# EAGLE design tresor (EAGLE 5.10)
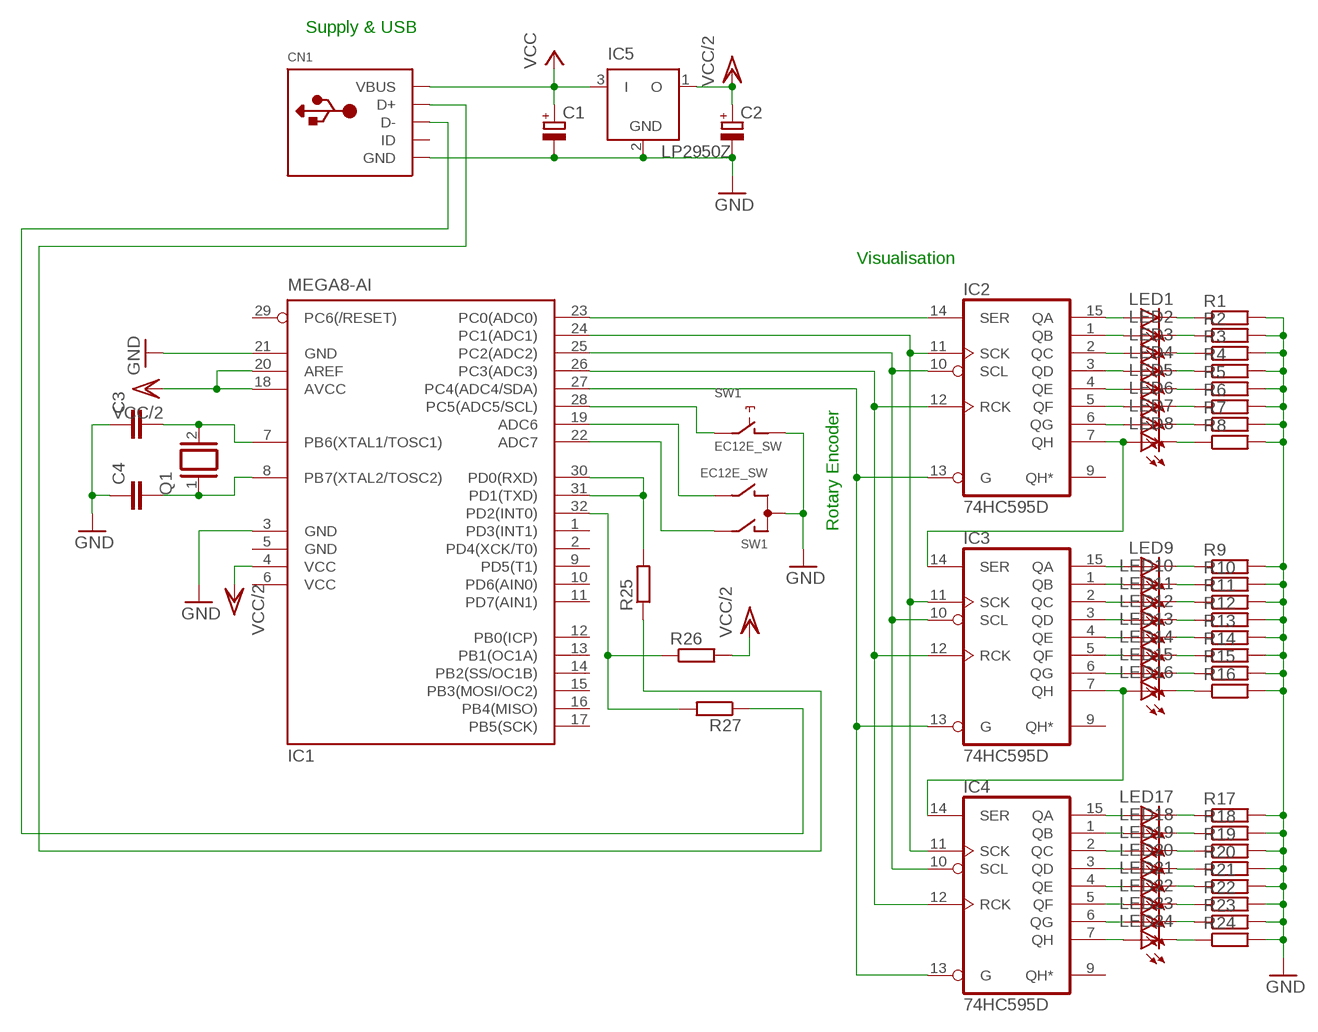
[diagram p0: schematic, sheet 1]

## Parts
C1  CPOL-EUE2.5-5  [E2,5-5]
C2  CPOL-EUE2.5-5  [E2,5-5]
C3  C-EUC0805  [C0805]
C4  C-EUC0805  [C0805]
CN1  USBMINIB  [USB-MINIB]
IC1  MEGA8-AI  [TQFP32-08]
IC2  74HC595D  [SO16]
IC3  74HC595D  [SO16]
IC4  74HC595D  [SO16]
IC5  LP2950Z  [TO92]
LED1  LED3MM  [LED3MM]
LED2  LED3MM  [LED3MM]
LED3  LED3MM  [LED3MM]
LED4  LED3MM  [LED3MM]
LED5  LED3MM  [LED3MM]
LED6  LED3MM  [LED3MM]
LED7  LED3MM  [LED3MM]
LED8  LED3MM  [LED3MM]
LED9  LED3MM  [LED3MM]
LED10  LED3MM  [LED3MM]
LED11  LED3MM  [LED3MM]
LED12  LED3MM  [LED3MM]
LED13  LED3MM  [LED3MM]
LED14  LED3MM  [LED3MM]
LED15  LED3MM  [LED3MM]
LED16  LED3MM  [LED3MM]
LED17  LED3MM  [LED3MM]
LED18  LED3MM  [LED3MM]
LED19  LED3MM  [LED3MM]
LED20  LED3MM  [LED3MM]
LED21  LED3MM  [LED3MM]
LED22  LED3MM  [LED3MM]
LED23  LED3MM  [LED3MM]
LED24  LED3MM  [LED3MM]
Q1  XTAL/S  [QS]
R1  R-EU_M0805  [M0805]
R2  R-EU_M0805  [M0805]
R3  R-EU_M0805  [M0805]
R4  R-EU_M0805  [M0805]
R5  R-EU_M0805  [M0805]
R6  R-EU_M0805  [M0805]
R7  R-EU_M0805  [M0805]
R8  R-EU_M0805  [M0805]
R9  R-EU_M0805  [M0805]
R10  R-EU_M0805  [M0805]
R11  R-EU_M0805  [M0805]
R12  R-EU_M0805  [M0805]
R13  R-EU_M0805  [M0805]
R14  R-EU_M0805  [M0805]
R15  R-EU_M0805  [M0805]
R16  R-EU_M0805  [M0805]
R17  R-EU_M0805  [M0805]
R18  R-EU_M0805  [M0805]
R19  R-EU_M0805  [M0805]
R20  R-EU_M0805  [M0805]
R21  R-EU_M0805  [M0805]
R22  R-EU_M0805  [M0805]
R23  R-EU_M0805  [M0805]
R24  R-EU_M0805  [M0805]
R25  R-EU_M0805  [M0805]
R26  R-EU_M0805  [M0805]
R27  R-EU_M0805  [M0805]
SW1  EC12E_SW  [ALPS_EC12E_SW]

## Nets
D+: CN1.D+ R25.1
D-: CN1.D- R27.1
GND: C1.- C2.- C3.1 C4.1 CN1.GND IC1.3(GND) IC1.21(GND) IC5.2(GND) R1.2 R2.2 R3.2 R4.2 R5.2 R6.2 R7.2 R8.2 R9.2 R10.2 R11.2 R12.2 R13.2 R14.2 R15.2 R16.2 R17.2 R18.2 R19.2 R20.2 R21.2 R22.2 R23.2 R24.2 SW1.C SW1.D
N$1: IC2.15(QA) LED1.A
N$2: IC2.1(QB) LED2.A
N$3: IC2.2(QC) LED3.A
N$4: IC2.3(QD) LED4.A
N$5: IC2.4(QE) LED5.A
N$6: IC2.5(QF) LED6.A
N$7: IC2.6(QG) LED7.A
N$8: IC2.7(QH) IC3.14(SER) LED8.A
N$9: IC3.15(QA) LED9.A
N$10: IC3.1(QB) LED10.A
N$11: IC3.2(QC) LED11.A
N$12: IC3.3(QD) LED12.A
N$13: IC3.4(QE) LED13.A
N$14: IC3.5(QF) LED14.A
N$15: IC3.6(QG) LED15.A
N$16: IC3.7(QH) IC4.14(SER) LED16.A
N$17: IC4.15(QA) LED17.A
N$18: IC4.1(QB) LED18.A
N$19: IC4.2(QC) LED19.A
N$20: IC4.3(QD) LED20.A
N$21: IC4.4(QE) LED21.A
N$22: IC4.5(QF) LED22.A
N$23: IC4.6(QG) LED23.A
N$24: IC4.7(QH) LED24.A
N$25: LED24.K(C) R24.1
N$26: LED23.K(C) R23.1
N$27: LED22.K(C) R22.1
N$28: LED21.K(C) R21.1
N$29: LED20.K(C) R20.1
N$30: LED19.K(C) R19.1
N$31: LED18.K(C) R18.1
N$32: LED17.K(C) R17.1
N$33: LED16.K(C) R16.1
N$34: LED15.K(C) R15.1
N$35: LED14.K(C) R14.1
N$36: LED13.K(C) R13.1
N$37: LED12.K(C) R12.1
N$38: LED11.K(C) R11.1
N$39: LED10.K(C) R10.1
N$40: LED9.K(C) R9.1
N$41: LED8.K(C) R8.1
N$42: LED7.K(C) R7.1
N$43: LED6.K(C) R6.1
N$44: LED5.K(C) R5.1
N$45: LED4.K(C) R4.1
N$46: LED3.K(C) R3.1
N$47: LED2.K(C) R2.1
N$48: LED1.K(C) R1.1
N$50: IC1.23(PC0(ADC0)) IC2.14(SER)
N$51: IC1.25(PC2(ADC2)) IC2.10(SCL) IC3.10(SCL) IC4.10(SCL)
N$52: IC1.24(PC1(ADC1)) IC2.11(SCK) IC3.11(SCK) IC4.11(SCK)
N$53: IC1.28(PC5(ADC5/SCL)) SW1.E
N$54: IC1.19(ADC6) SW1.B
N$55: IC1.22(ADC7) SW1.A
N$57: C3.2 IC1.7(PB6(XTAL1/TOSC1)) Q1.2
N$58: C4.2 IC1.8(PB7(XTAL2/TOSC2)) Q1.1
N$59: IC1.30(PD0(RXD)) IC1.31(PD1(TXD)) R25.2
N$60: IC1.32(PD2(INT0)) R26.1 R27.2
N$62: IC1.26(PC3(ADC3)) IC2.12(RCK) IC3.12(RCK) IC4.12(RCK)
N$63: IC1.27(PC4(ADC4/SDA)) IC2.13(G) IC3.13(G) IC4.13(G)
VCC: C1.+ CN1.VBUS IC5.3(I)
VCC/2: C2.+ IC1.4(VCC) IC1.18(AVCC) IC1.20(AREF) IC5.1(O) R26.2
Unconnected: CN1.ID IC1.1(PD3(INT1)) IC1.2(PD4(XCK/T0)) IC1.9(PD5(T1)) IC1.10(PD6(AIN0)) IC1.11(PD7(AIN1)) IC1.12(PB0(ICP)) IC1.13(PB1(OC1A)) IC1.14(PB2(SS/OC1B)) IC1.15(PB3(MOSI/OC2)) IC1.16(PB4(MISO)) IC1.17(PB5(SCK)) IC1.29(PC6(/RESET)) IC2.9(QH*) IC3.9(QH*) IC4.9(QH*) SW1.GND1(G) SW1.GND2(G)

## Notes on the sheet
- Supply & USB
- Visualisation
- Rotary Encoder

## Power pins joined to a net without a drawn wire
GND: IC1.5(GND) IC2.8(GND) IC3.8(GND) IC4.8(GND)
VCC: IC1.6(VCC) IC2.16(VCC) IC3.16(VCC) IC4.16(VCC)

## Library data of the parts
C1 C2 = resistor:CPOL-EU: POLARIZED CAPACITOR, European symbol
C3 C4 = resistor:C-EU: CAPACITOR, European symbol
CN1 = adafruit:USB: USB Connectors USBMINIB - Surface Mount Female Mini-B USB Connector 4UConnector: 06564 By microbuilder.eu Thru-hole RA Female Mini-B USB Connector 4UConnector: 18732 By ladyada.net
IC1 = atmel:MEGA8: MICROCONTROLLER 8 Kbytes FLASH, 1 kbytes SRAM, 512 bytes EEPROM, USART, 6-channel 10 bit ADC, 2-channel 8 bit ADC Pin compatible with Atmega48, ATMega88, ATMega168 Source: avr.lbr
IC2-IC4 = 74xx-eu:74*595: 8-bit SHIFT REGISTER, output latch
IC5 = linear:LP2950: 100 mA, Low Power Low Dropout Voltage Regulator Source: http://www.onsemi.com/pub/Collateral/LP2950-D.PDF
LED1-LED24 = led:LED: LED OSRAM: - CHIPLED LG R971, LG N971, LY N971, LG Q971, LY Q971, LO R971, LY R971 LH N974, LH R974 LS Q976, LO Q976, LY Q976 LO Q996 - Hyper CHIPLED LW Q18S LB Q993, LB Q99A, LB R99A - SideLED LS A670, LO A670, LY A670, LG A670, LP A670 LB A673, LV A673, LT A673, LW A673 LH A674 LY A675 LS A676, LA A676, LO A676, LY A676, LW A676 LS A679, LY A679, LG A679 - Hyper Micro SIDELED® LS Y876, LA Y876, LO Y876, LY Y876 LT Y87S - SmartLED LW L88C, LW L88S LB L89C, LB L89S, LG L890 LS L89K, LO L89K, LY L89K LS L896, LA L896, LO L896, LY L896 - TOPLED LS T670, LO T670, LY T670, LG T670, LP T670 LSG T670, LSP T670, LSY T670, LOP T670, LYG T670 LG T671, LOG T671, LSG T671 LB T673, LV T673, LT T673, LW T673 LH T674 LS T676, LA T676, LO T676, LY T676, LB T676, LH T676, LSB T676, LW T676 LB T67C, LV T67C, LT T67C, LS T67K, LO T67K, LY T67K, LW E67C LS E67B, LA E67B, LO E67B, LY E67B, LB E67C, LV E67C, LT E67C LW T67C LS T679, LY T679, LG T679 LS T770, LO T770, LY T770, LG T770, LP T770 LB T773, LV T773, LT T773, LW T773 LH T774 LS E675, LA E675, LY E675, LS T675 LS T776, LA T776, LO T776, LY T776, LB T776 LHGB T686 LT T68C, LB T68C - Hyper Mini TOPLED® LB M676 - Mini TOPLED Santana® LG M470 LS M47K, LO M47K, LY M47K Source: http://www.osram.convergy.de LUXEON: - LUMILED® LXK2-PW12-R00, LXK2-PW12-S00, LXK2-PW14-U00, LXK2-PW14-V00 LXK2-PM12-R00, LXK2-PM12-S00, LXK2-PM14-U00 LXK2-PE12-Q00, LXK2-PE12-R00, LXK2-PE12-S00, LXK2-PE14-T00, LXK2-PE14-U00 LXK2-PB12-K00, LXK2-PB12-L00, LXK2-PB12-M00, LXK2-PB14-N00, LXK2-PB14-P00, LXK2-PB14-Q00 LXK2-PR12-L00, LXK2-PR12-M00, LXK2-PR14-Q00, LXK2-PR14-R00 LXK2-PD12-Q00, LXK2-PD12-R00, LXK2-PD12-S00 LXK2-PH12-R00, LXK2-PH12-S00 LXK2-PL12-P00, LXK2-PL12-Q00, LXK2-PL12-R00 Source: www.luxeon.com KINGBRIGHT: KA-3528ASYC Source: www.kingbright.com
Q1 = special:XTAL/S: CRYSTAL
R1-R27 = resistor:R-EU_: RESISTOR, European symbol
SW1 = switch-alps:EC12E_SW: ALPS rotary Encoder EC12E series with switch

## Board
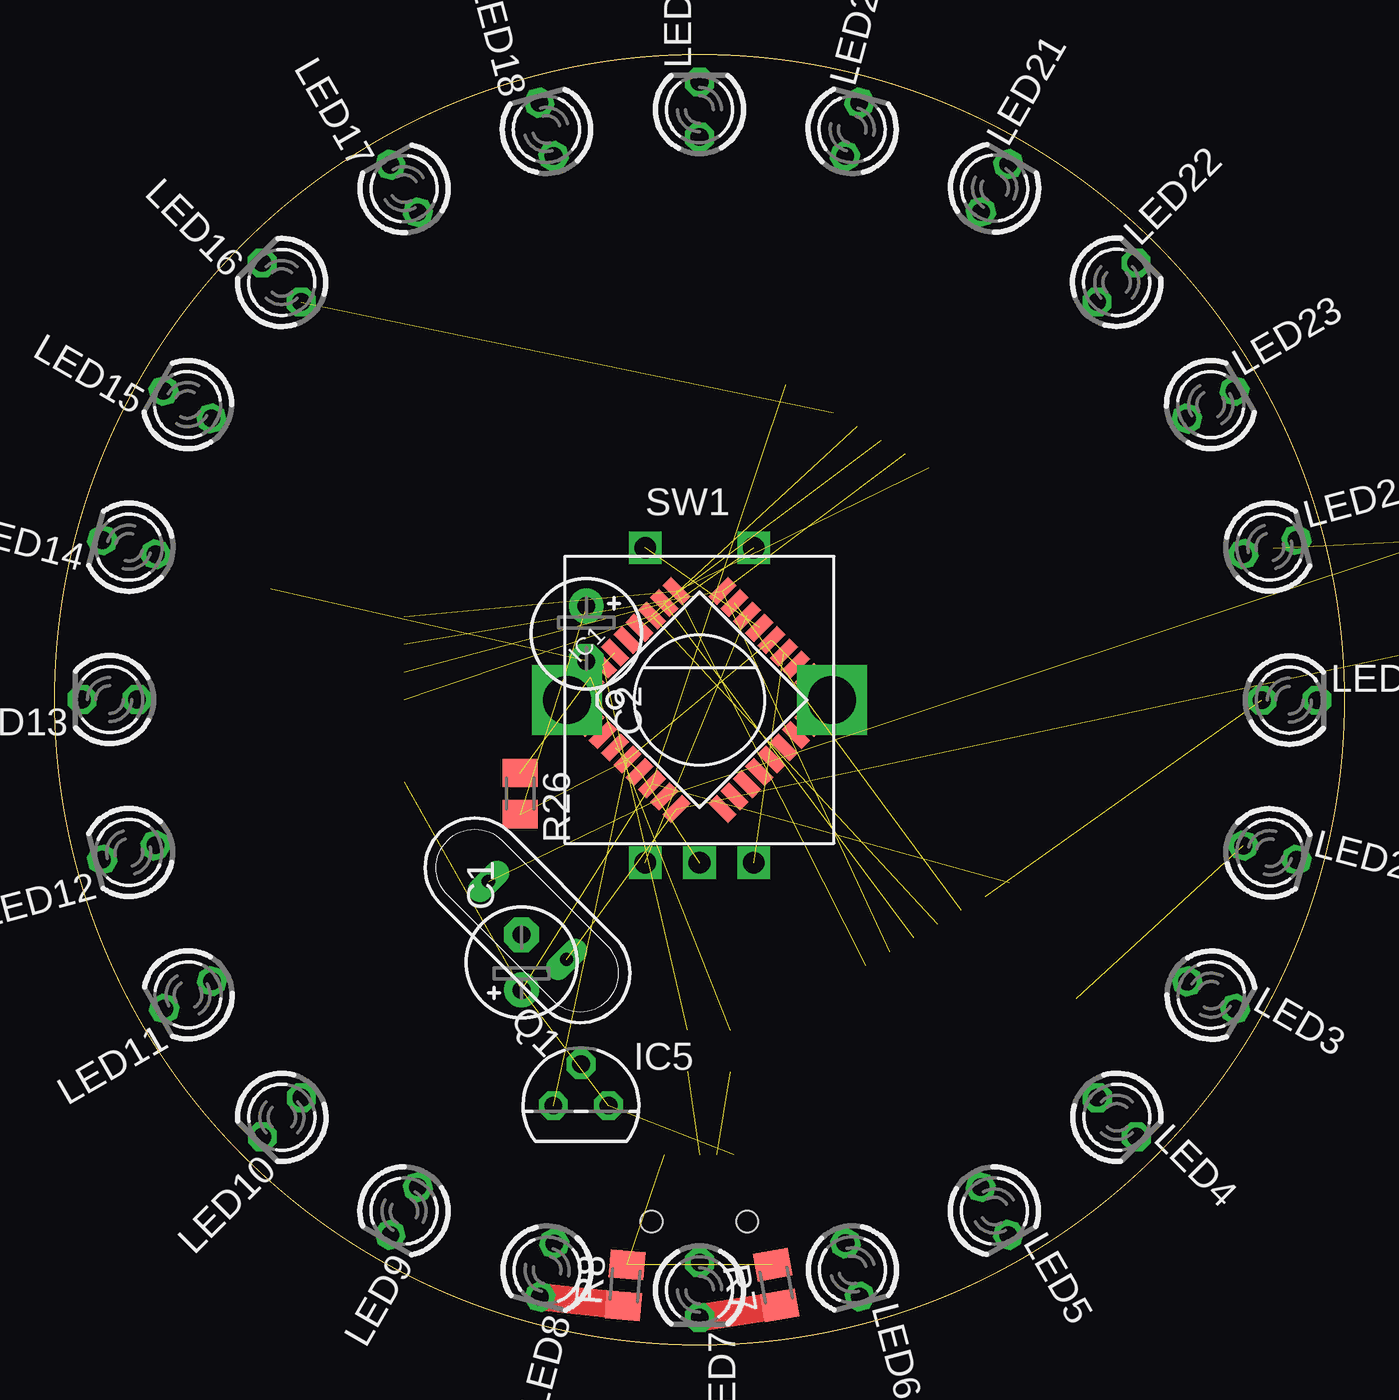
[diagram p1: board, top side]
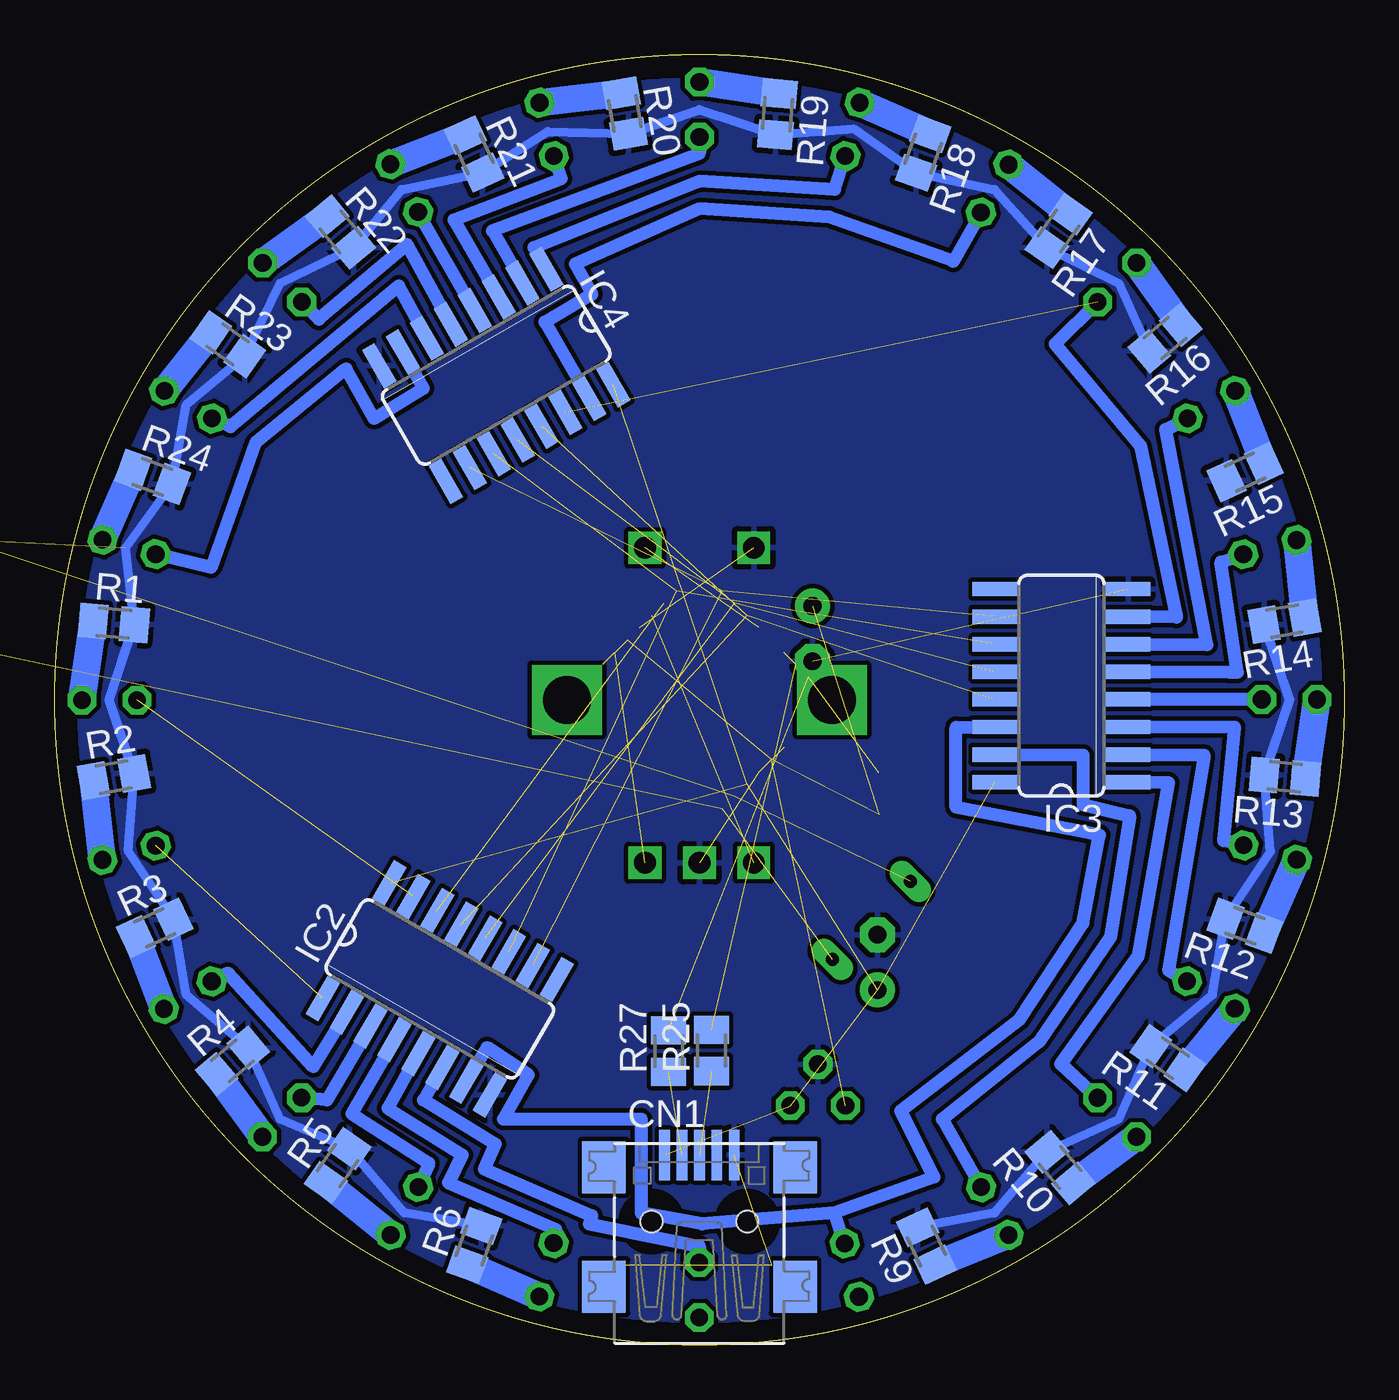
[diagram p2: board, bottom side, seen from below]

Size 59.39 x 59.39 mm. Coordinates in mm from the lower left corner, seen from the top.
Outline: circle at 29.69,29.69 radius 29.69
Copper layers (1*16): Top 0.035mm / dielectric 1.5mm / Bottom 0.035mm
Design rules "default": minimum track width 10mil, minimum drill 24mil, track to track 8mil, track to pad 8mil, pad to pad 8mil, via to via 8mil, smd to smd 8mil, copper to edge 40mil, drill to drill 8mil, minimum pad ring 10mil, minimum via ring 8mil, stop-mask expansion 4mil, vias tented up to drill 0mil, thermal gap 10mil

### Footprints (pad centres in the part's own frame; a part is rotated, then mirrored left to right if it is on the bottom)
E2,5-5 = drill 0.813 pad 1.6 round: + -1.27,0 | drill 0.813 pad 1.6 octagon: - 1.27,0
C0805 = smd 1.3 x 1.5: 1 -0.85,0; 2 0.85,0
USB-MINIB = smd 0.5 x 2.308: D+ 0,4.064; D- -0.8,4.064; GND 1.6,4.064; ID 0.8,4.064; VBUS -1.6,4.064 | smd 2 x 2.4: GND1 -4.4,-2; GND2 -4.4,3.5; GND3 4.4,3.5; GND4 4.4,-2 | hole 1: -2.2,1; 2.2,1
TQFP32-08 = smd 1.27 x 0.559: 1 -4.293,2.8; 2 -4.293,2; 3 -4.293,1.2; 4 -4.293,0.4; 5 -4.293,-0.4; 6 -4.293,-1.2; 7 -4.293,-2; 8 -4.293,-2.8; 17 4.293,-2.8; 18 4.293,-2; 19 4.293,-1.2; 20 4.293,-0.4; 21 4.293,0.4; 22 4.293,1.2; 23 4.293,2; 24 4.293,2.8 | smd 0.559 x 1.27: 9 -2.8,-4.293; 10 -2,-4.293; 11 -1.2,-4.293; 12 -0.4,-4.293; 13 0.4,-4.293; 14 1.2,-4.293; 15 2,-4.293; 16 2.8,-4.293; 25 2.8,4.293; 26 2,4.293; 27 1.2,4.293; 28 0.4,4.293; 29 -0.4,4.293; 30 -1.2,4.293; 31 -2,4.293; 32 -2.8,4.293
SO16 = smd 0.66 x 2.032: 1 -4.445,-3.073; 2 -3.175,-3.073; 3 -1.905,-3.073; 4 -0.635,-3.073; 5 0.635,-3.073; 6 1.905,-3.073; 7 3.175,-3.073; 8 4.445,-3.073; 9 4.445,3.073; 10 3.175,3.073; 11 1.905,3.073; 12 0.635,3.073; 13 -0.635,3.073; 14 -1.905,3.073; 15 -3.175,3.073; 16 -4.445,3.073
TO92 = drill 0.813 octagon: 1 -1.27,0; 2 0,1.905; 3 1.27,0
LED3MM = drill 0.813 octagon: A -1.27,0; K 1.27,0
QS = drill 0.61 long: 1 -2.54,0; 2 2.54,0
M0805 = smd 1.3 x 1.6: 1 -0.95,0; 2 0.95,0
ALPS_EC12E_SW = drill 1 square: A -2.5,-7.5; B 2.5,-7.5; C 0,-7.5; D -2.5,7; E 2.5,7 | drill 2.2 square: GND1 -6.1,0; GND2 6.1,0

### Placement (x,y rotation side)
C1  21.5,17.61 90 top
C2  24.49,32.74 270 top
C3  83.79,42.9 90 top  (outside the outline)
C4  83.41,37.19 270 top  (outside the outline)
CN1  29.69,4.67 0 bottom
IC1  29.69,29.69 45 top
IC2  41.65,16.39 330 bottom
IC3  13.03,30.35 90 bottom
IC4  39.05,44.64 210 bottom
IC5  24.24,11.01 0 top
LED1  56.85,29.68 0 top
LED2  55.95,22.65 345 top
LED3  53.25,16.1 330 top
LED4  48.91,10.48 315 top
LED5  43.27,6.16 300 top
LED6  36.74,3.45 285 top
LED7  29.7,2.52 270 top
LED8  22.68,3.44 255 top
LED9  16.09,6.16 240 top
LED10  10.47,10.47 225 top
LED11  6.15,16.11 210 top
LED12  3.42,22.67 195 top
LED13  2.53,29.71 180 top
LED14  3.43,36.72 165 top
LED15  6.12,43.28 150 top
LED16  10.46,48.91 135 top
LED17  16.1,53.23 120 top
LED18  22.65,55.95 105 top
LED19  29.69,56.87 90 top
LED20  36.72,55.95 75 top
LED21  43.28,53.25 60 top
LED22  48.9,48.91 45 top
LED23  53.23,43.28 30 top
LED24  55.95,36.73 15 top
Q1  21.77,19.54 135 top
R1  56.65,33.23 355 bottom
R2  56.66,26.14 10 bottom
R3  54.77,19.19 25 bottom
R4  51.19,13.07 40 bottom
R5  46.35,8.26 55 bottom
R6  40.06,4.58 70 bottom
R7  33.23,2.76 100 top
R8  26.27,2.74 85 top
R9  19.25,4.55 115 bottom
R10  13.09,8.17 130 bottom
R11  8.13,13.2 145 bottom
R12  4.59,19.29 160 bottom
R13  2.74,26.15 175 bottom
R14  2.76,33.32 190 bottom
R15  4.57,40.19 205 bottom
R16  8.26,46.35 220 bottom
R17  13.16,51.28 235 bottom
R18  19.39,54.85 250 bottom
R19  26.1,56.66 265 bottom
R20  33.12,56.69 280 bottom
R21  40.07,54.83 295 bottom
R22  46.22,51.23 310 bottom
R23  51.41,46.06 325 bottom
R24  54.87,39.96 340 bottom
R25  29.14,13.55 90 bottom
R26  21.44,25.38 270 top
R27  31.11,13.52 90 bottom
SW1  29.69,29.69 0 top

### Tracks (layer width: path | path; a pad name or v marks a point on that pad's centre or on a via)
D+  (1 unrouted)
D-  (1 unrouted)
GND  (8 unrouted)
  Bottom 0.406: R16.2 10.39,48.87 R17.2 16.1,53.19 R18.2 22.58,55.98 R19.2 29.69,56.87 R20.2 36.68,55.85 R21.2 43.41,53.19 R22.2 49,48.87 R23.2 53.31,43.28 R24.2 56.11,36.68 R1.2 56.87,29.69 R2.2 55.98,22.71 R3.2 53.31,16.1 R4.2 49,10.39 R5.2 43.28,6.07 R6.2 | R14.2 2.51,29.69 R13.2 3.4,22.71 R12.2 6.07,16.1 R11.2 10.39,10.39 R10.2 16.1,6.07 R9.2
  pour Bottom: 29.69,59.41 arc-90 59.41,29.69 arc-90 29.69,-0.02 arc-90 -0.03,29.69 arc-90
N$1  (1 unrouted)
N$2  (1 unrouted)
N$3
  Bottom 0.61: IC2.2 47.47,12.8 51.41,17.12 LED3.A
N$4
  Bottom 0.61: IC2.3 46.84,11.28 LED4.A
N$5
  Bottom 0.61: IC2.4 45.69,10.64 42.14,8.36 LED5.A
N$6
  Bottom 0.61: IC2.5 44.04,10.9 40.61,8.74 41.25,7.47 36.3,5.31 LED6.A
N$7
  Bottom 0.61: IC2.6 42.39,11.28 39.09,9.25 39.6,8.1 34.65,5.94 34.77,5.56 29.69,4.55 LED7.A
N$8
  Bottom 0.61: IC3.14 17.88,28.42 17.88,24.74 11.28,23.47 12.04,19.41 14.96,14.96 20.42,10.77 18.9,7.72 23.47,6.07 | IC2.7 39.47,13.69 37.57,12.42 38.71,10.39 32.36,10.39 32.36,6.07 29.57,5.56 23.47,6.07 | LED8.A 23.47,6.07
N$9
  Bottom 0.61: IC3.15 12.04,27.15 12.04,24.87 9.88,24.36 10.77,18.77 14.07,13.94 18.52,10.39 LED9.A
N$10
  Bottom 0.61: IC3.1 8.1,25.88 9.5,17.88 13.06,12.93 LED10.A
N$11
  Bottom 0.61: IC3.2 6.45,27.15 8.1,17.25 LED11.A
N$12
  Bottom 0.61: IC3.3 5.05,28.42 5.56,23.22 LED12.A
N$13
  Bottom 0.61: LED13.A IC3.4
N$14
  Bottom 0.61: IC3.5 5.31,30.96 4.93,30.96 5.69,36.04 LED14.A
N$15
  Bottom 0.61: IC3.6 6.32,32.23 8.23,42.14 LED15.A
N$16  (1 unrouted)
  Bottom 0.61: IC3.7 7.72,33.5 9.37,41.38 13.31,46.08 LED16.A
N$17
  Bottom 0.61: IC4.15 36.8,47.09 34.65,48.36 35.41,49.76 29.69,52.3 23.72,51.92 18.01,49.89 LED17.A
N$18
  Bottom 0.61: IC4.1 37.31,50.52 29.69,53.57 23.47,53.19 LED18.A
N$19
  Bottom 0.61: IC4.2 39.22,51.28 29.69,54.84 LED19.A
N$20
  Bottom 0.61: IC4.3 41,51.79 36.04,53.7 LED20.A
N$21
  Bottom 0.61: IC4.4 LED21.A
N$22
  Bottom 0.61: IC4.5 43.16,50.65 47.22,47.22 LED22.A
N$23
  Bottom 0.61: IC4.6 43.54,48.74 51.28,42.27 LED23.A
N$24
  Bottom 0.61: LED24.A 52.17,35.79 50.14,41.5 45.95,44.93 44.68,42.65 42.39,44.04 IC4.7
N$25
  Bottom 1.27: LED24.K R24.1
N$26
  Bottom 1.27: LED23.K R23.1
N$27
  Bottom 1.27: R22.1 LED22.K
N$28
  Bottom 1.27: R21.1 LED21.K
N$29
  Bottom 1.27: R20.1 LED20.K
N$30
  Bottom 1.27: R19.1 LED19.K
N$31
  Bottom 1.27: R18.1 LED18.K
N$32
  Bottom 1.27: R17.1 LED17.K
N$33
  Bottom 1.27: R16.1 LED16.K
N$34
  Bottom 1.27: R15.1 LED15.K
N$35
  Bottom 1.27: R14.1 LED14.K
N$36
  Bottom 1.27: LED13.K R13.1
N$37
  Bottom 1.27: R12.1 LED12.K
N$38
  Bottom 1.27: LED11.K R11.1
N$39
  Bottom 1.27: R10.1 LED10.K
N$40
  Bottom 1.27: LED9.K R9.1
N$41
  Top 1.27: LED8.K R8.1
N$42
  Top 1.27: LED7.K R7.1
N$43
  Bottom 1.27: LED6.K R6.1
N$44
  Bottom 1.27: LED5.K R5.1
N$45
  Bottom 1.27: LED4.K R4.1
N$46
  Bottom 1.27: LED3.K R3.1
N$47
  Bottom 1.27: LED2.K R2.1
N$48
  Bottom 1.27: R1.1 LED1.K
N$50  (1 unrouted)
N$51  (3 unrouted)
N$52  (3 unrouted)
N$53  (1 unrouted)
N$54  (1 unrouted)
N$55  (1 unrouted)
N$57  (2 unrouted)
N$58  (2 unrouted)
N$59  (2 unrouted)
N$60  (2 unrouted)
N$62  (3 unrouted)
N$63  (3 unrouted)
VCC  (6 unrouted)
VCC/2  (5 unrouted)